# Altium schematic sheet Temperature.SchDoc: Temperature Sensor
size A4; DocumentNumber: 5; Revision: 0v1; SheetNumber: 5; SheetTotal: 9
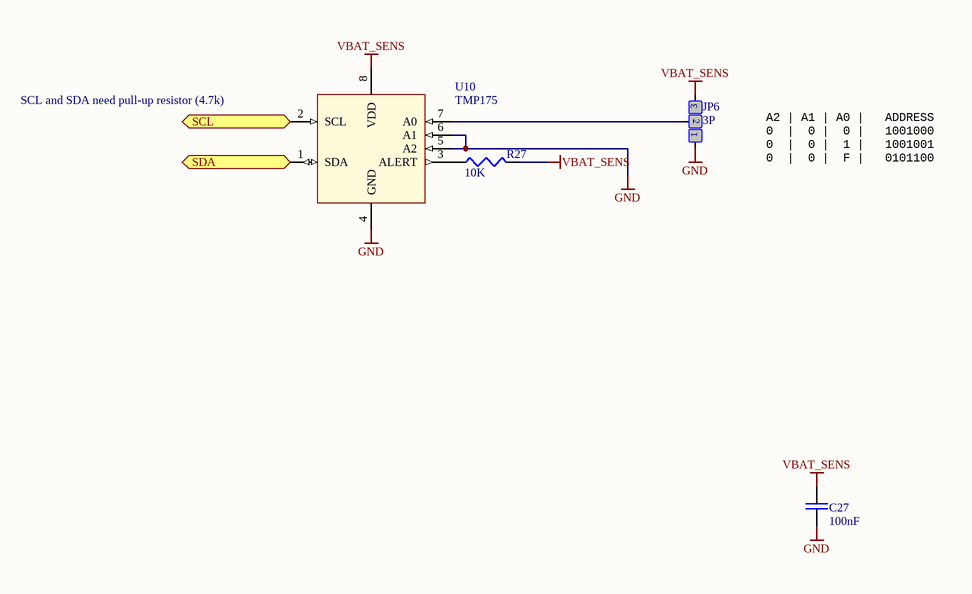
[diagram p0: Temperature.SchDoc]

## Parts
C27  100nF  [0603]
JP6  3P  [SOLDER-3-0603]  (no BOM)
R27  10K  [0603]
U10  TMP175  [SOIC-8]

## Ports
SCL (in), SDA (bidir)

## Nets
GND: C27.1 JP6.1 U10.4(GND) U10.5(A2) U10.6(A1)
VBAT_SENS: C27.2 JP6.3 R27.2 U10.8(VDD)
SCL: U10.2(SCL) ; port SCL
SDA: U10.1(SDA) ; port SDA
NetJP6_2: JP6.2 U10.7(A0)
NetR27_1: R27.1 U10.3(ALERT)

## Notes on the sheet
- SCL and SDA need pull-up resistor (4.7k)
- A2 | A1 | A0 |   ADDRESS
  0  |  0 |  0 |   1001000
  0  |  0 |  1 |   1001001
  0  |  0 |  F |   0101100
- Title
- Size:
- Date:
- A4
- Number:
- Time:
- Revision:
- Sheet
- of
- File:

## Library data of the parts
C27 = CAP: Capacitor; Owner: Nuno Brum; Sub-Type: Ceramic; Assembly: INS; Maximum Voltage: *; Creation Date: 2005-04-28; Status: Valid; Validation date: 2006-05-15; Type: Capacitor
JP6 = SOLDER3: Solder Jumper 3 positions; Owner: Rui Rebelo; STATE1: 0; Assembly: PCB; Validation Date: 2006-05-15; Type: PCB; Creation Date: 2006-02-27; Status: Valid; Sub-Type: Jumper
R27 = RES: Resistor; Owner: Nuno Brum; Sub-Type: Generic; Assembly: INS; Validation date: 2006-05-15; Creation Date: 2002-07-17; Status: Valid; Power: *; Type: Resistor
U10 = TMP175: Digital Temperature Sensor; Type: IC; Creation Date: 2012-03-05